# EAGLE design Zenith (EAGLE 9.5.0)
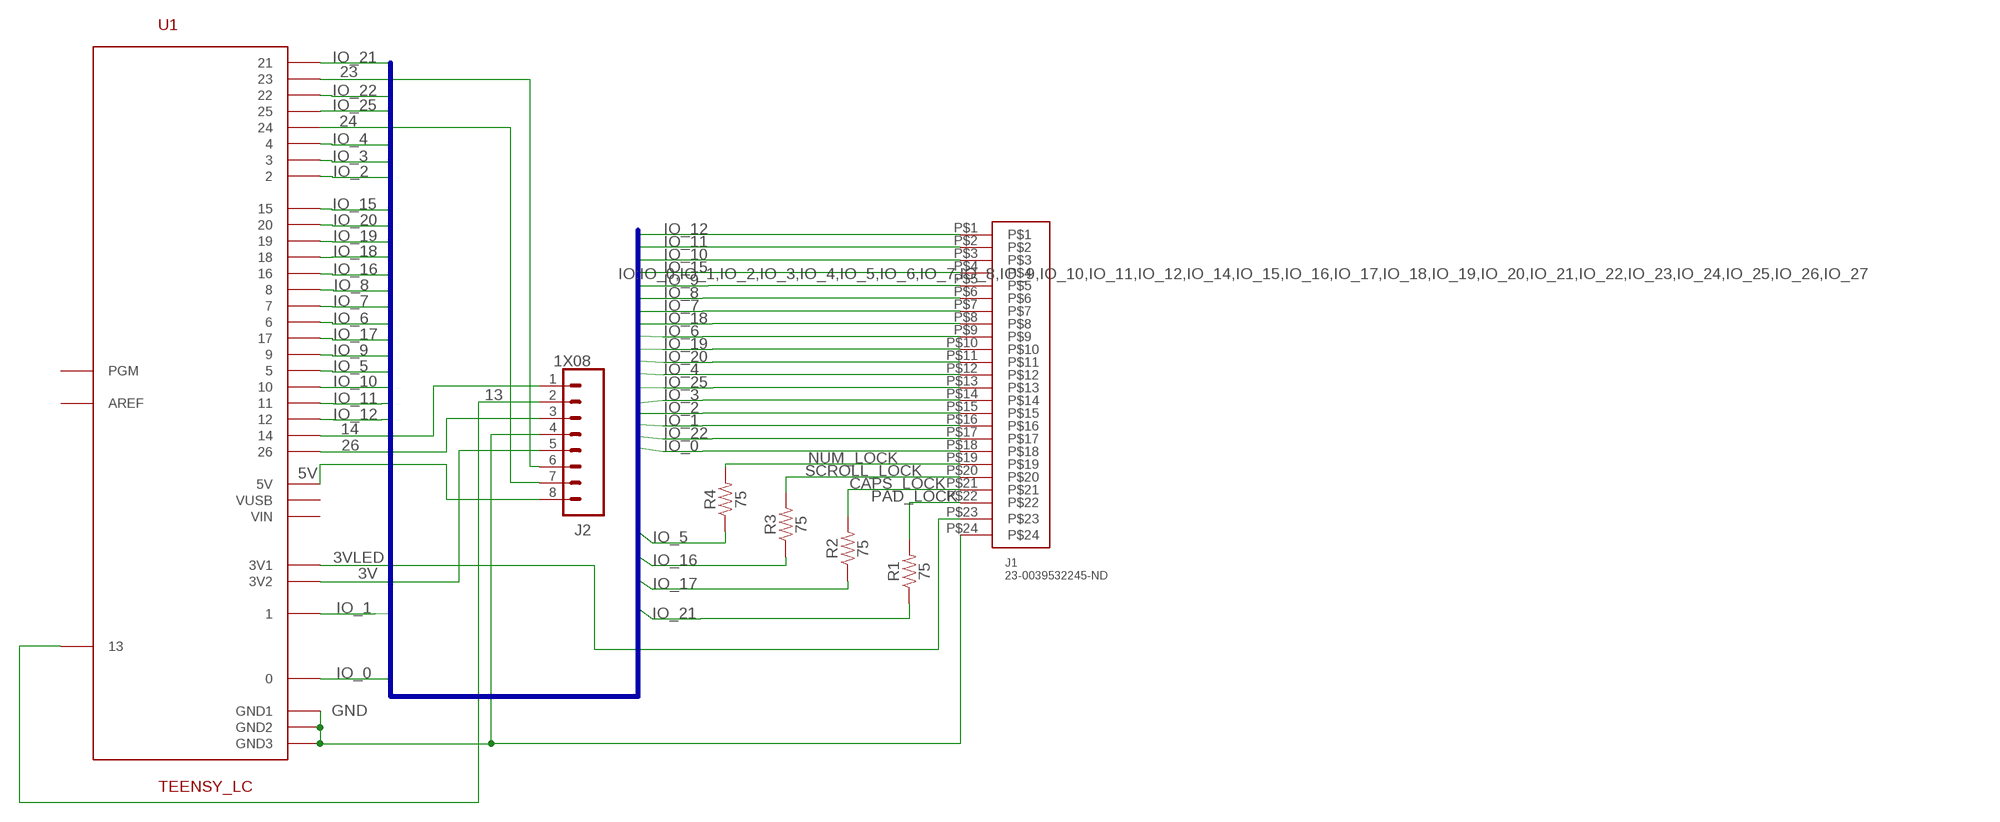
[diagram p0: schematic, sheet 1]

## Parts
J1  23-0039532245-ND  ZENITH_CON  [ZENITH_CON]
J2  1X08  CONN_08"  [1X08]
R1  75  RESISTOR_AXIAL  [AXIAL-0.3]
R2  75  RESISTOR_AXIAL  [AXIAL-0.3]
R3  75  RESISTOR_AXIAL  [AXIAL-0.3]
R4  75  RESISTOR_AXIAL  [AXIAL-0.3]
U1  TEENSY_LC  [TEENSY_LC]

## Nets
3V: J2.5 U1.3V2
3VLED: J1.P$23 U1.3V1
5V: J2.8 U1.5V
13: J2.2 U1.13
14: J2.1 U1.14
23: J2.6 U1.23
24: J2.7 U1.24
26: J2.3 U1.26
CAPS_LOCK: J1.P$21 R2.P$2
GND: J1.P$24 J2.4 U1.GND1 U1.GND2 U1.GND3
IO_0: J1.P$18 U1.0
IO_1: J1.P$16 U1.1
IO_2: J1.P$15 U1.2
IO_3: J1.P$14 U1.3
IO_4: J1.P$12 U1.4
IO_5: R4.P$1 U1.5
IO_6: J1.P$9 U1.6
IO_7: J1.P$7 U1.7
IO_8: J1.P$6 U1.8
IO_9: J1.P$5 U1.9
IO_10: J1.P$3 U1.10
IO_11: J1.P$2 U1.11
IO_12: J1.P$1 U1.12
IO_15: J1.P$4 U1.15
IO_16: R3.P$1 U1.16
IO_17: R2.P$1 U1.17
IO_18: J1.P$8 U1.18
IO_19: J1.P$10 U1.19
IO_20: J1.P$11 U1.20
IO_21: R1.P$1 U1.21
IO_22: J1.P$17 U1.22
IO_25: J1.P$13 U1.25
NUM_LOCK: J1.P$19 R4.P$2
PAD_LOCK: J1.P$22 R1.P$2
SCROLL_LOCK: J1.P$20 R3.P$2
Unconnected: U1.AREF U1.PGM U1.VIN U1.VUSB

## Buses
IO:IO_0,IO_1,IO_2,IO_3,IO_4,IO_5,IO_6,IO_7,IO_8,IO_9,IO_10,IO_11,IO_12,IO_14,IO_15,IO_16,IO_17,IO_18,IO_19,IO_20,IO_21,IO_22,IO_23,IO_24,IO_25,IO_26,IO_27

## Library data of the parts
J1 = Zenith:ZENITH_CON
J2 = SparkFun-Connectors:CONN_08: Multi connection point. Often used as Generic Header-pin footprint for 0.1 inch spaced/style header connections On any of the 0.1 inch spaced packages, you can populate with these: Break Away Headers - Straight <https://www.sparkfun.com/products/116> (PRT-00116) Break Away Male Headers - Right Angle <https://www.sparkfun.com/products/553> (PRT-00553) Female Headers <https://www.sparkfun.com/products/115> (PRT-00115) Break Away Headers - Machine Pin <https://www.sparkfun.com/products/117> (PRT-00117) Break Away Female Headers - Swiss Machine Pin <https://www.sparkfun.com/products/743> (PRT-00743) Arduino Stackable Header - 8 Pin <https://www.sparkfun.com/products/9279> (PRT-09279) For SCREWTERMINALS and SPRING TERMINALS visit here: Screw Terimnals on SparkFun.com <https://www.sparkfun.com/search/results?term=Screw+Terminals> (5mm/3.5mm/2.54mm spacing) This device is also useful as a general connection point to wire up your design to another part of your project. Our various solder wires solder well into these plated through hole pads. Hook-Up Wire - Assortment (Stranded, 22 AWG) <https://www.sparkfun.com/products/11375> (PRT-11375) Hook-Up Wire - Assortment (Solid Core, 22 AWG) <https://www.sparkfun.com/products/11367> (PRT-11367) View the entire wire category on our website here <https://www.sparkfun.com/categories/141> Special notes: Molex polarized connector foot print use with SKU : PRT-08231 with associated crimp pins and housings. 1MM SMD Version SKU: PRT-10208 NOTES ON THE VARIANTS LOCK and LOCK_LONGPADS... This footprint was designed to help hold the alignment of a through-hole component (i.e. 6-pin header) while soldering it into place. You may notice that each hole has been shifted either up or down by 0.005 of an inch from it's more standard position (which is a perfectly straight line). This slight alteration caused the pins (the squares in the middle) to touch the edges of the holes. Because they are alternating, it causes a "brace" to hold the component in place. 0.005 has proven to be the perfect amount of "off-center" position when using our standard breakaway headers. Although looks a little odd when you look at the bare footprint, once you have a header in there, the alteration is very hard to notice. Also,if you push a header all the way into place, it is covered up entirely on the bottom side.; PROD_ID: CONN-08438
R1-R4 = Resistor_Axial:RESISTOR_AXIAL
U1 = Teensy_LC:TEENSY_LC

## Board
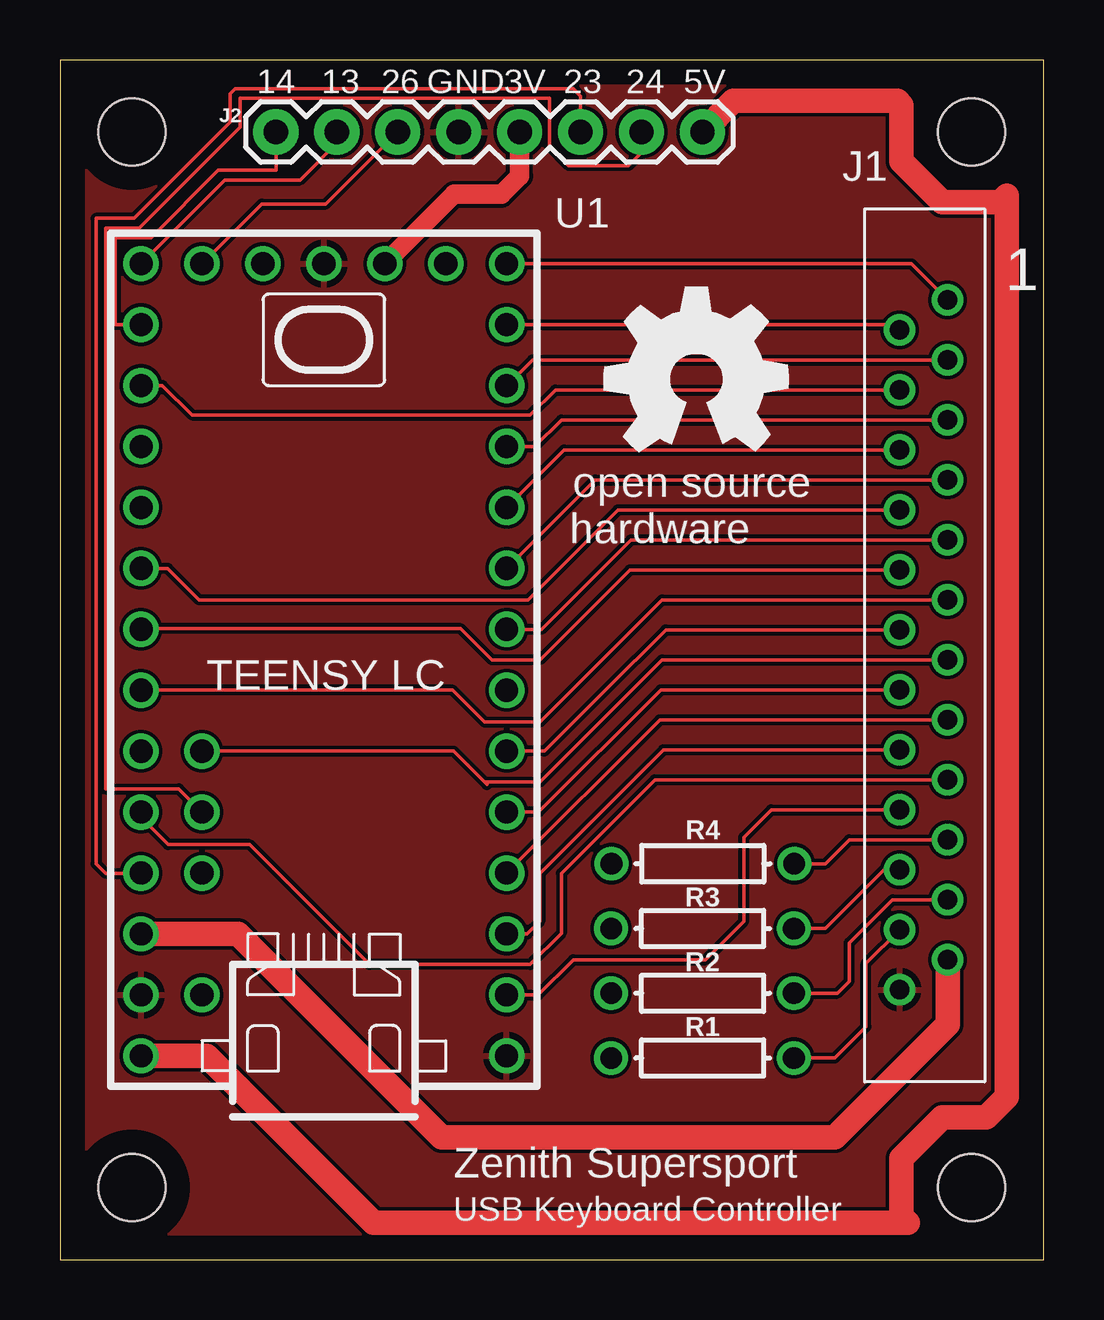
[diagram p1: board, top side]
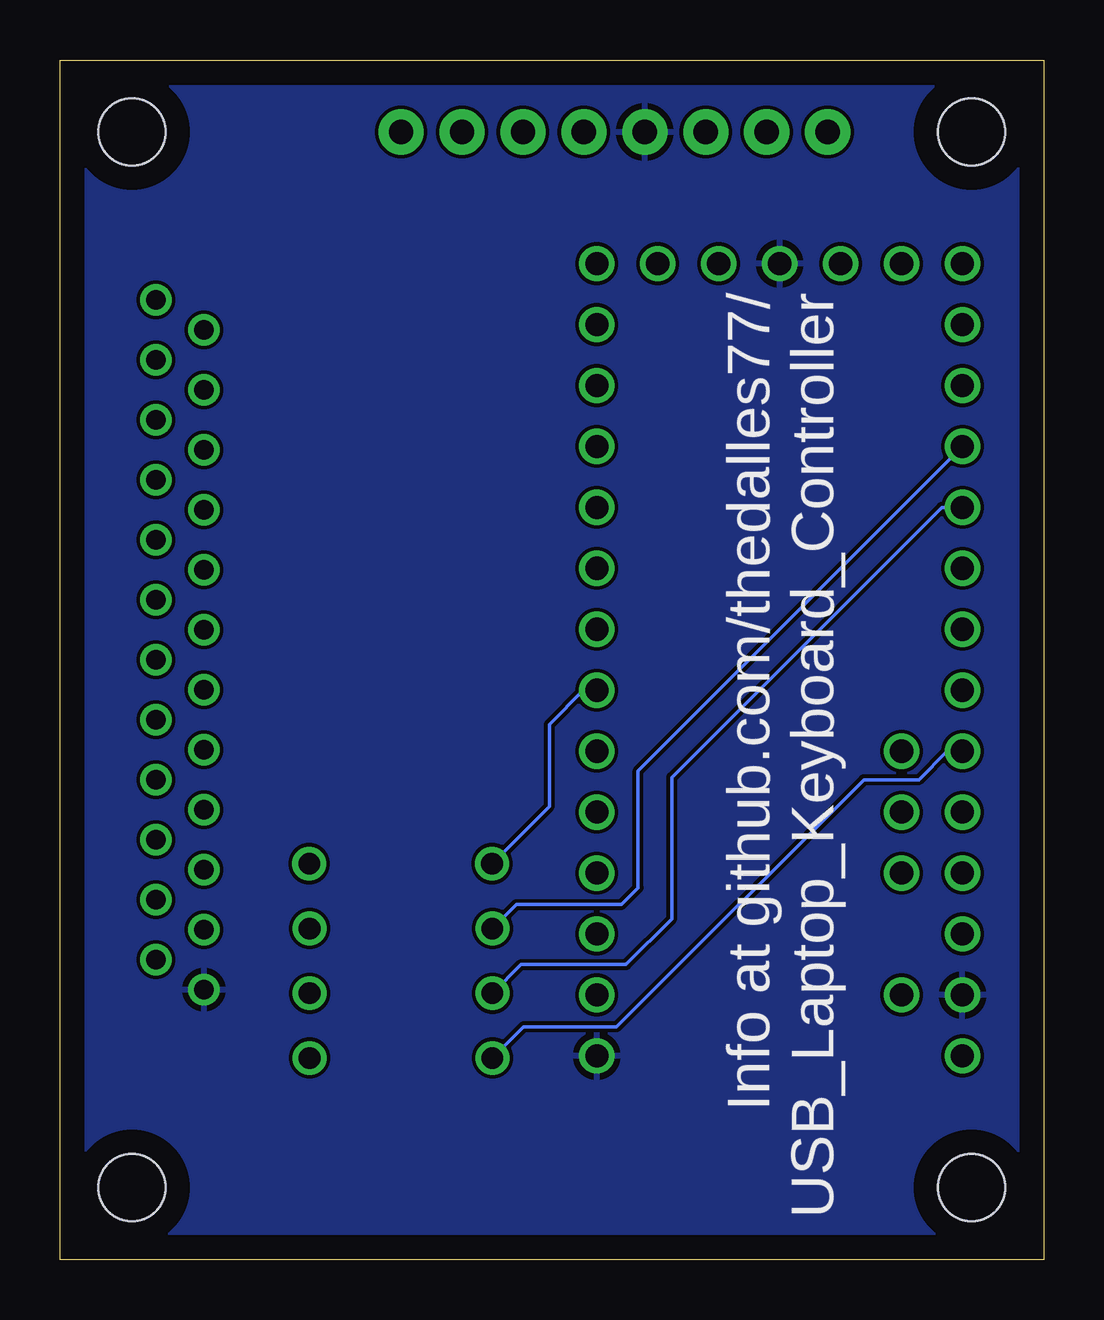
[diagram p2: board, bottom side, seen from below]

Size 41 x 50 mm. Coordinates in mm from the lower left corner, seen from the top.
Outline: 0,0 41,0 41,50 0,50 0,0
Copper layers (1*16): Top 0.035mm / dielectric 1.5mm / Bottom 0.035mm
Design rules "default": minimum track width 6mil, minimum drill 0.35mm, track to track 6mil, track to pad 6mil, pad to pad 6mil, via to via 6mil, smd to smd 6mil, copper to edge 40mil, drill to drill 6mil, minimum pad ring 10mil, minimum via ring 8mil, stop-mask expansion 4mil, vias tented up to drill 0mil, thermal gap 10mil
Holes 2.8 mm at 3,3 38,3 38,47 3,47

### Footprints (pad centres in the part's own frame; a part is rotated, then mirrored left to right if it is on the bottom)
ZENITH_CON = drill 0.8: P$1 0,2; P$2 1.25,0; P$3 2.5,2; P$4 3.75,0; P$5 5,2; P$6 6.25,0; P$7 7.5,2; P$8 8.75,0; P$9 10,2; P$10 11.25,0; P$11 12.5,2; P$12 13.75,0; P$13 15,2; P$14 16.25,0; P$15 17.5,2; P$16 18.75,0; P$17 20,2; P$18 21.25,0; P$19 22.5,2; P$20 23.75,0; P$21 25,2; P$22 26.25,0; P$23 27.5,2; P$24 28.75,0
1X08 = drill 1.016 pad 1.88: 1 0,0; 2 2.54,0; 3 5.08,0; 4 7.62,0; 5 10.16,0; 6 12.7,0; 7 15.24,0; 8 17.78,0
AXIAL-0.3 = drill 0.9: P$1 -3.81,0; P$2 3.81,0
TEENSY_LC = drill 0.965: 0 -13.97,-7.62; 1 -11.43,-7.62; 2 -8.89,-7.62; 3 -6.35,-7.62; 3V1 -11.43,7.62; 3V2 16.51,-2.54; 4 -3.81,-7.62; 5 -1.27,-7.62; 5V -16.51,7.62; 6 1.27,-7.62; 7 3.81,-7.62; 8 6.35,-7.62; 9 8.89,-7.62; 10 11.43,-7.62; 11 13.97,-7.62; 12 16.51,-7.62; 13 16.51,7.62; 14 13.97,7.62; 15 11.43,7.62; 16 8.89,7.62; 17 6.35,7.62; 18 3.81,7.62; 19 1.27,7.62; 20 -1.27,7.62; 21 -3.81,7.62; 22 -6.35,7.62; 23 -8.89,7.62; 24 -6.35,5.08; 25 -3.81,5.08; 26 16.51,5.08; AREF -8.89,5.08; GND1 -16.51,-7.62; GND2 -13.97,7.62; GND3 16.51,0; PGM 16.51,2.54; VIN 16.51,-5.08; VUSB -13.97,5.08

### Placement (x,y rotation side)
J1  35,40 270 top
J2  9,47 0 top
R1  26.78,8.4 0 top
R2  26.78,11.1 0 top
R3  26.78,13.8 0 top
R4  26.8,16.5 0 top
U1  11,25 90 top
U$2  [OSHW_8MM]  26.5,36.7 0 top

### Tracks (layer width: path | path; a pad name or v marks a point on that pad's centre or on a via)
3V
  Top 0.813: U1.3V2 16.43,44.4 18.4,44.4 19.16,45.16 J2.5
3VLED
  Top 1.016: U1.3V1 7.43,13.57 15.9,5.1 32.3,5.1 37,9.8 J1.P$23
5V
  Top 1.016: U1.5V 6.11,8.49 13.08,1.52 35.34,1.52 35.08,1.79 35.08,4.21 36.79,5.92 38.62,5.92 39.48,6.78 39.48,12.5 39.48,44.34 39.21,44.08 36.79,44.08 35.08,45.79 35.08,48.12 34.9,48.3 28.08,48.3 J2.8
13
  Top 0.152: U1.13 6.87,45 10,45 11.54,46.54 J2.2
14
  Top 0.152: U1.14 2.3,38.97 2.3,42.6 3.8,42.6 6.6,45.4 9,45.4 J2.1
23
  Top 0.152: J2.6 21.7,48.5 21.4,48.8 7.3,48.8 7.1,48.6 7.1,47.4 3.1,43.4 1.5,43.4 1.5,16.5 1.9,16.1 U1.23
24
  Top 0.152: U1.24 4.96,19.61 1.9,19.61 1.9,43 3.3,43 7.5,47.2 7.5,48.4 20.4,48.4 20.4,46.4 21.2,45.6 23.7,45.6 24.24,46.14 J2.7
26
  Top 0.152: U1.26 8.41,44 11.08,44 J2.3
CAPS_LOCK
  Top 0.152: R2.P$2 32.4,11.1 32.9,11.6 32.9,13.2 34.7,15 J1.P$21
GND
  pour Top: 0,0 0,50 41,50 41,0
  pour Bottom: 0,0 0,50 41,50 41,0
IO_0
  Top 0.152: U1.0 19.93,11.03 21.4,12.5 26.9,12.5 28.5,14.1 28.5,17.6 29.65,18.75 J1.P$18
IO_1
  Top 0.152: J1.P$16 25.15,21.25 20,16.1 20,14.1 19.47,13.57 U1.1
IO_2
  Top 0.152: J1.P$15 25.01,22.5 U1.2
IO_3
  Top 0.152: J1.P$14 25.05,23.75 19.95,18.65 U1.3
IO_4
  Top 0.152: U1.4 20.19,21.19 23.95,24.95 24,25 25.25,26.25 J1.P$12
IO_5
  Bottom 0.152: R4.P$1 20.6,18.89 20.6,22.3 19.17,23.73 U1.5
IO_6
  Top 0.152: J1.P$9 23.8,30 20.07,26.27 U1.6
IO_7
  Top 0.152: J1.P$7 22.31,32.5 U1.7
IO_8
  Top 0.152: J1.P$6 21.02,33.75 U1.8
IO_9
  Top 0.152: U1.9 19.79,33.89 20.9,35 J1.P$5
IO_10
  Top 0.152: U1.10 19.69,37.5 J1.P$3
IO_11
  Top 0.152: U1.11 34.78,38.97 J1.P$2
IO_12
  Top 0.152: U1.12 35.49,41.51 J1.P$1
IO_15
  Top 0.152: U1.15 4.27,36.43 5.5,35.2 19.6,35.2 20.65,36.25 J1.P$4
IO_16
  Bottom 0.152: U1.16 16.9,20.37 16.9,15.5 17.6,14.8 21.97,14.8 R3.P$1
IO_17
  Bottom 0.152: U1.17 4.25,31.35 15.5,20.1 15.5,14.2 17.4,12.3 21.77,12.3 R2.P$1
IO_18
  Top 0.152: J1.P$8 23.25,31.25 19.5,27.5 5.8,27.5 4.49,28.81 U1.18
IO_19
  Top 0.152: J1.P$10 23.75,28.75 20,25 18,25 16.7,26.3 3.41,26.3 U1.19
IO_20
  Top 0.152: U1.20 16.37,23.73 17.7,22.4 20,22.4 25.1,27.5 J1.P$11
IO_21
  Bottom 0.152: U1.21 4.01,21.19 5.2,20 7.5,20 17.8,9.7 21.67,9.7 R1.P$1
IO_22
  Top 0.152: J1.P$17 24.8,20 20.9,16.1 20.9,13.6 19.6,12.3 12.9,12.3 7.9,17.3 4.5,17.3 3.38,18.42 U1.22
IO_25
  Top 0.152: U1.25 16.41,21.19 17.7,19.9 | 17.7,19.9 17.8,19.8 | 17.7,19.9 20,19.9 25.1,25 J1.P$13
NUM_LOCK
  Top 0.152: R4.P$2 31.9,16.5 32.9,17.5 J1.P$19
PAD_LOCK
  Top 0.152: R1.P$2 32.3,8.4 33.6,9.7 33.6,12.35 J1.P$22
SCROLL_LOCK
  Top 0.152: R3.P$2 31.9,13.8 34.35,16.25 J1.P$20

### Text on the board
tPlace: 14 | 13 | 26 | GND | 3V | 23 | 24 | 5V | U1 | 1 | Zenith Supersport | USB Keyboard Controller
bPlace: Info at github.com/thedalles77/ / USB_Laptop_Keyboard_Controller